# Altium schematic sheet LPF(500Hz).SchDoc
size A; SheetNumber: 6; SheetTotal: 6
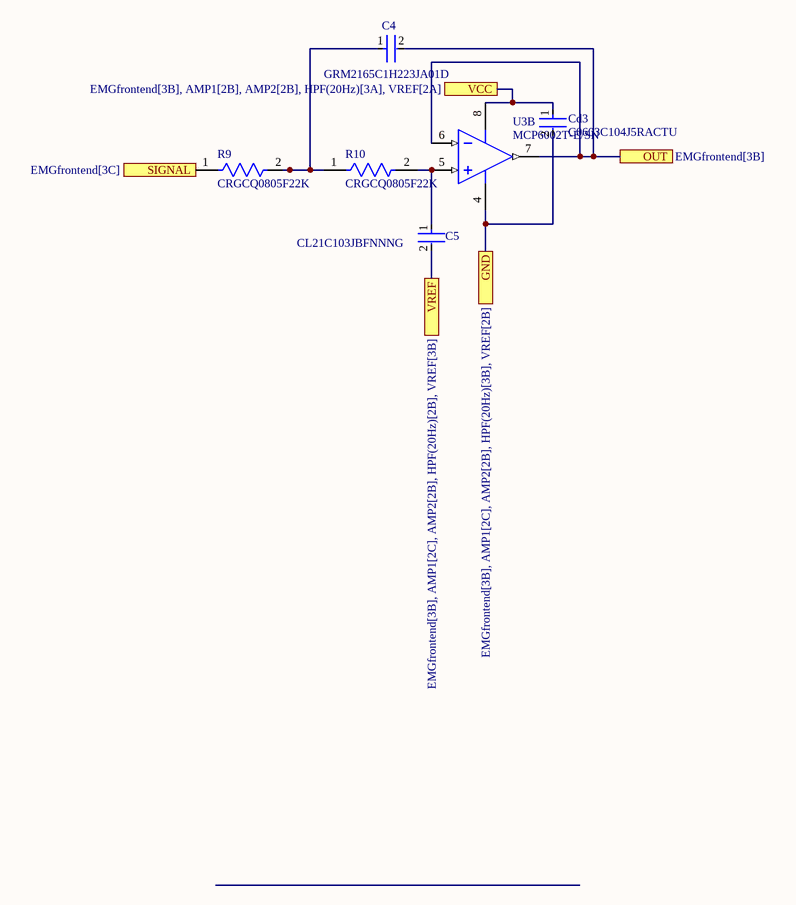
[diagram p0: LPF(500Hz).SchDoc]

## Parts
C4  GRM2165C1H223JA01D  [FP-GRM216-0_1-0_05-MFG]
C5  CL21C103JBFNNNG  [FP-CL21-IPC_B]
Cd3  C0603C104J5RACTU  [FP-C0603C-CF-MFG]
R9  CRGCQ0805F22K  [FP-CRGCQ0805-IPC_C]
R10  CRGCQ0805F22K  [FP-CRGCQ0805-IPC_C]
U3  MCP6002T-E/SN  [SOIC-SN8_N]  (part B of 2)

## Ports
GND (see EMGfrontend[3B], AMP1[2C], AMP2[2B], HPF(20Hz)[3B], VREF[2B]), OUT (see EMGfrontend[3B]), SIGNAL (see EMGfrontend[3C]), VCC (see EMGfrontend[3B], AMP1[2B], AMP2[2B], HPF(20Hz)[3A], VREF[2A]), VREF (see EMGfrontend[3B], AMP1[2C], AMP2[2B], HPF(20Hz)[2B], VREF[3B])

## Nets
GND: Cd3.2 U3.4(VSS) ; port GND
OUT: C4.2 U3.6(VINB-) U3.7(VOUTB) ; port OUT
SIGNAL: R9.1 ; port SIGNAL
VCC: Cd3.1 U3.8(VDD) ; port VCC
VREF: C5.2 ; port VREF
NetC4_1: C4.1 R9.2 R10.1
NetC5_1: C5.1 R10.2 U3.5(VINB+)

## Library data of the parts
C4 = CMP-06035-050815-1: 22000pF
C5 = CMP-13271-003702-1: 10nF; Voltage Rating: 50V; Dielectric: C0G; Tolerance: 5%; Temperature Coefficient: 300ppm/°C; Packaging: Tape and Reel; Package Quantity: 3000; Case Code (Imperial): 0805; Mount: Surface Mount; Max Operating Temperature: 125°C; Case Code (Metric): 2012; Width: 0.049inch; Thickness: 0.053inch; Depth: 1.25mm; Case/Package: 0805; Capacitance: 10nF; Min Operating Temperature: -55°C; Voltage: 50V; Length: 2mm; Height: 1.25mm; Radiation Hardening: No
Cd3 = CMP-2006-03056-2: CAP CER 0.1UF 50V 5% X7R 0603; Manufacturer: KEMET; Automotive Grade: Grade 1; Tolerance: 0.05; Capacitance: 0.10 μF; Value: 0.10 μF; Temperature Coefficient: 30ppm/°C; ComponentLink2Description: Datasheet; Voltage Rating: 50 V; Digikey Description: CAP CER 0.1UF 50V 5% X7R 0603; Manufacturer Part Number: C0603C104J5RACTU; Temperature Range High: +125°C; Device Class L2: Capacitors; Octopart: https://octopart.com/c0603c104j5ractu-kemet-10440638; RoHS: TRUE; Mouser Description: Multilayer Ceramic Capacitors MLCC - SMD/SMT 50volts 0.1uF X7R 5%; Temperature Range Low: -55°C; Automotive: Yes; Lead Free: Yes; ComponentLink2URL: https://api.kemet.com/component-edge/download/datasheet/C0603C100J5GACAUTO.pdf; Material: Ceramic; Device Class L3: Ceramic Capacitors; Package: C0603C-CF; Category: Cap; Temperature: -55°C to +125°C; Height: 0.87mm; Temperature Characteristic: X7R; Device Class L1: Passive Components
R9 R10 = CMP-03211-003824-1: CRGCQ0805 22KΩ 0.125W ±100ppm/°C 1% 150V; Manufacturer: TE Connectivity; Automotive Grade: Grade 985; Tolerance: 0.01; Temperature Coefficient: ±100ppm/°C; Octopart: https://octopart.com/crgcq0805f22k-te+connectivity-91018161; Manufacturer Part Number: CRGCQ0805F22K; Power Rating: 0.125W; Series: CRGCQ; Device Class L1: Passive Components; Composition: Thick Film; Lead Free: Yes; Ipc Land Pattern Name: RESC200125X55; ComponentLink2URL: https://www.te.com/commerce/DocumentDelivery/DDEController?Action=showdoc&DocId=Data+Sheet%7F1773204-3%7F1%7Fpdf%7FEnglish%7FENG_DS_1773204-3_1.pdf%7F4-2176341-994; Device Class L3: Chip SMD Resistors; Package: CRGCQ0805; Temperature Range Low: -55°C; Voltage Rating: 150V; Value: 22KΩ; Temperature: -55°C to +155°C; ComponentLink2Description: Datasheet; Automotive: Yes; Height: 0.65mm; Device Class L2: Resistors; RoHS: TRUE; Ambient Temperature Range High: +70°C; Temperature Range High: +155°C; Resistance: 22KΩ; Category: Res
U3 = CMP-0187-00363-3: None; Nominal Supply Current: 100uA; Operating Supply Voltage: 5.5V; Input Bias Current: 1pA; Output Current per Channel: 23mA; Unity Gain Bandwidth Product: 1MHz; Number of Elements: 2; Power Supply Rejection Ratio (PSRR): 86dB; Slew Rate: 0.6V/µs; Min Supply Voltage: 1.8V; Voltage Gain: 112dB; Max Supply Voltage: 6V; Input Offset Voltage (Vos): 4.5mV; Common Mode Rejection Ratio: 60dB; Amplifier Type: GENERAL PURPOSE; Technology: CMOS; Output Current: 23mA; Number of Pins: 8; Lead Free: Lead Free; Number of Channels: 2; Package Quantity: 3300; Max Operating Temperature: 125°C; Number of Circuits: 2; Supply Current: 100uA; Gain Bandwidth Product: 1MHz; Min Operating Temperature: -40°C; Series: -; Mount: Surface Mount; Case/Package: SOIC; Radiation Hardening: No; Packaging: Tape and Reel; Operating Supply Current: 100uA; RoHS Compliant: Yes